# EAGLE design Schematic (EAGLE 7.3.0)
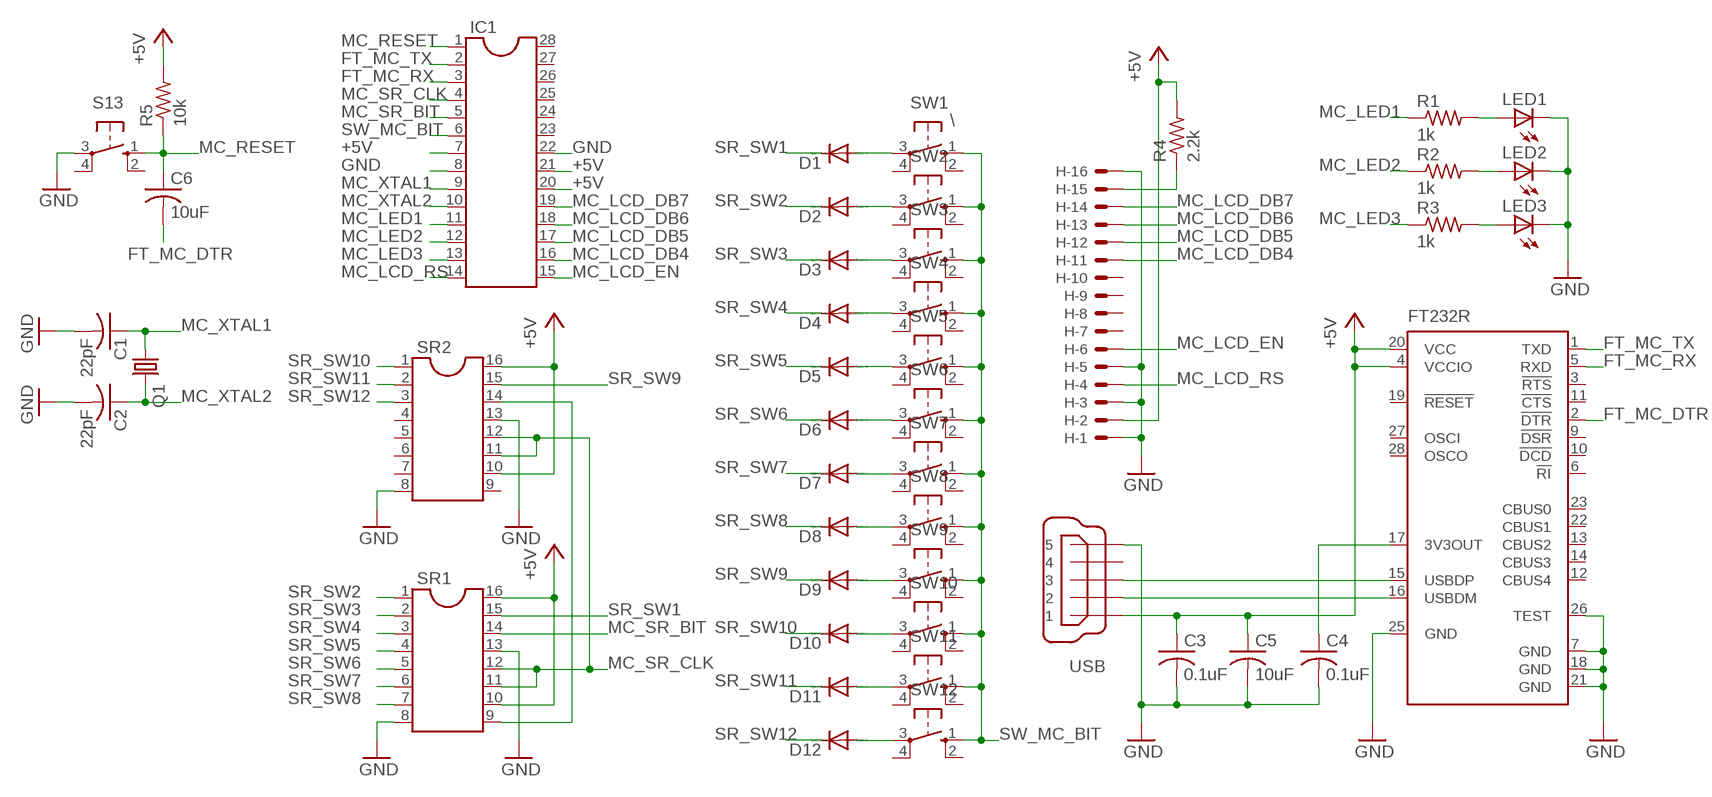
[diagram p0: schematic, sheet 1]

## Parts
C1  22pF  C-US025-024X044  [C025-024X044]
C2  22pF  C-US025-024X044  [C025-024X044]
C3  0.1uF  C-US025-024X044  [C025-024X044]
C4  0.1uF  C-US025-024X044  [C025-024X044]
C5  10uF  C-US025-024X044  [C025-024X044]
C6  10uF  C-US025-024X044  [C025-024X044]
D1  DIODE-DO35-10  [DO35-10]
D2  DIODE-DO35-10  [DO35-10]
D3  DIODE-DO35-10  [DO35-10]
D4  DIODE-DO35-10  [DO35-10]
D5  DIODE-DO35-10  [DO35-10]
D6  DIODE-DO35-10  [DO35-10]
D7  DIODE-DO35-10  [DO35-10]
D8  DIODE-DO35-10  [DO35-10]
D9  DIODE-DO35-10  [DO35-10]
D10  DIODE-DO35-10  [DO35-10]
D11  DIODE-DO35-10  [DO35-10]
D12  DIODE-DO35-10  [DO35-10]
FT232R  FT232RL  [SSOP28]
H  C-GRID-16-70543  [70543-16]
IC1  DIL28-3  [DIL28-3]
LED1  LED3MM  [LED3MM]
LED2  LED3MM  [LED3MM]
LED3  LED3MM  [LED3MM]
Q1  CRYSTALHC49U-V  [HC49U-V]
R1  1k  R-US_0204/2V  [0204V]
R2  1k  R-US_0204/2V  [0204V]
R3  1k  R-US_0204/2V  [0204V]
R4  2.2k  R-US_0204/2V  [0204V]
R5  10k  R-US_0204/2V  [0204V]
S13  10-XX  [B3F-10XX]
SR1  DIL16  [DIL16]
SR2  DIL16  [DIL16]
SW1  \  10-XX  [B3F-10XX]
SW2  10-XX  [B3F-10XX]
SW3  10-XX  [B3F-10XX]
SW4  10-XX  [B3F-10XX]
SW5  10-XX  [B3F-10XX]
SW6  10-XX  [B3F-10XX]
SW7  10-XX  [B3F-10XX]
SW8  10-XX  [B3F-10XX]
SW9  10-XX  [B3F-10XX]
SW10  10-XX  [B3F-10XX]
SW11  10-XX  [B3F-10XX]
SW12  10-XX  [B3F-10XX]
USB  MINI-USB_SHIELD5P2-32005-601  [32005-601]

## Nets
+5V: C3.1 C5.1 FT232R.4(VCCIO) FT232R.20(VCC) H.2 IC1.7 IC1.20 IC1.21 R4.2 R5.2 SR1.10 SR1.16 SR2.10 SR2.16 USB.1
FT_MC_DTR: C6.2 FT232R.2(!DTR)
FT_MC_RX: FT232R.5(RXD) IC1.3
FT_MC_TX: FT232R.1(TXD) IC1.2
GND: C1.2 C2.2 C3.2 C4.2 C5.2 FT232R.7(GND) FT232R.18(GND) FT232R.21(GND) FT232R.25(GND) FT232R.26(TEST) H.1 H.3 H.5 H.16 IC1.8 IC1.22 LED1.K(C) LED2.K(C) LED3.K(C) S13.3(P) SR1.8 SR1.13 SR2.8 SR2.13 USB.5
IDK: SR1.9 SR2.14
MC_LCD_DB4: H.11 IC1.16
MC_LCD_DB5: H.12 IC1.17
MC_LCD_DB6: H.13 IC1.18
MC_LCD_DB7: H.14 IC1.19
MC_LCD_EN: H.6 IC1.15
MC_LCD_RS: H.4 IC1.14
MC_LED1: IC1.11 R1.1
MC_LED2: IC1.12 R2.1
MC_LED3: IC1.13 R3.1
MC_RESET: C6.1 IC1.1 R5.1 S13.1(S)
MC_SR_BIT: IC1.5 SR1.14
MC_SR_CLK: IC1.4 SR1.11 SR1.12 SR2.11 SR2.12
MC_XTAL1: C1.1 IC1.9 Q1.1
MC_XTAL2: C2.1 IC1.10 Q1.2
N$1: D12.A SW12.3(P)
N$2: D11.A SW11.3(P)
N$3: D10.A SW10.3(P)
N$4: D9.A SW9.3(P)
N$5: D8.A SW8.3(P)
N$6: D7.A SW7.3(P)
N$7: D6.A SW6.3(P)
N$8: D5.A SW5.3(P)
N$9: D4.A SW4.3(P)
N$10: D1.A SW1.3(P)
N$11: D2.A SW2.3(P)
N$12: D3.A SW3.3(P)
N$13: FT232R.15(USBDP) USB.3
N$14: FT232R.16(USBDM) USB.2
N$16: LED1.A R1.2
N$17: LED2.A R2.2
N$18: H.15 R4.1
N$19: LED3.A R3.2
N$20: C4.1 FT232R.17(3V3OUT)
SR_SW1: D1.C SR1.15
SR_SW2: D2.C SR1.1
SR_SW3: D3.C SR1.2
SR_SW4: D4.C SR1.3
SR_SW5: D5.C SR1.4
SR_SW6: D6.C SR1.5
SR_SW7: D7.C SR1.6
SR_SW8: D8.C SR1.7
SR_SW9: D9.C SR2.15
SR_SW10: D10.C SR2.1
SR_SW11: D11.C SR2.2
SR_SW12: D12.C SR2.3
SW_MC_BIT: IC1.6 SW1.1(S) SW2.1(S) SW3.1(S) SW4.1(S) SW5.1(S) SW6.1(S) SW7.1(S) SW8.1(S) SW9.1(S) SW10.1(S) SW11.1(S) SW12.1(S)
Unconnected: FT232R.3(!RTS) FT232R.6(!RI) FT232R.9(!DSR) FT232R.10(!DCD) FT232R.11(!CTS) FT232R.12(CBUS4) FT232R.13(CBUS2) FT232R.14(CBUS3) FT232R.19(!RESET) FT232R.22(CBUS1) FT232R.23(CBUS0) FT232R.27(OSCI) FT232R.28(OSCO) H.7 H.8 H.9 H.10 IC1.23 IC1.24 IC1.25 IC1.26 IC1.27 IC1.28 S13.2(S1) S13.4(P1) SR2.4 SR2.5 SR2.6 SR2.7 SR2.9 SW1.2(S1) SW1.4(P1) SW2.2(S1) SW2.4(P1) SW3.2(S1) SW3.4(P1) SW4.2(S1) SW4.4(P1) SW5.2(S1) SW5.4(P1) SW6.2(S1) SW6.4(P1) SW7.2(S1) SW7.4(P1) SW8.2(S1) SW8.4(P1) SW9.2(S1) SW9.4(P1) SW10.2(S1) SW10.4(P1) SW11.2(S1) SW11.4(P1) SW12.2(S1) SW12.4(P1) USB.4 USB.M1(S1) USB.M2(S2)

## Library data of the parts
C1-C6 = rcl:C-US: CAPACITOR, American symbol
D1-D12 = diode:DIODE-: DIODE
FT232R = ftdichip:FT232R: Source: http://www.ftdichip.com/Documents/DataSheets/DS_FT232R_v104.pdf; MPN: FT232RL; OC_FARNELL: 1146032; OC_NEWARK: 91K9918
H = con-molex:C-GRID-16: CONNECTOR wire to board 2.54 mm (0.100") pitch header; OC_FARNELL: unknown; OC_NEWARK: unknown
IC1 = ic-package:DIL28: Dual In Line
LED1-LED3 = led:LED: LED OSRAM: - CHIPLED LG R971, LG N971, LY N971, LG Q971, LY Q971, LO R971, LY R971 LH N974, LH R974 LS Q976, LO Q976, LY Q976 LO Q996 - Hyper CHIPLED LW Q18S LB Q993, LB Q99A, LB R99A - SideLED LS A670, LO A670, LY A670, LG A670, LP A670 LB A673, LV A673, LT A673, LW A673 LH A674 LY A675 LS A676, LA A676, LO A676, LY A676, LW A676 LS A679, LY A679, LG A679 - Hyper Micro SIDELED® LS Y876, LA Y876, LO Y876, LY Y876 LT Y87S - SmartLED LW L88C, LW L88S LB L89C, LB L89S, LG L890 LS L89K, LO L89K, LY L89K LS L896, LA L896, LO L896, LY L896 - TOPLED LS T670, LO T670, LY T670, LG T670, LP T670 LSG T670, LSP T670, LSY T670, LOP T670, LYG T670 LG T671, LOG T671, LSG T671 LB T673, LV T673, LT T673, LW T673 LH T674 LS T676, LA T676, LO T676, LY T676, LB T676, LH T676, LSB T676, LW T676 LB T67C, LV T67C, LT T67C, LS T67K, LO T67K, LY T67K, LW E67C LS E67B, LA E67B, LO E67B, LY E67B, LB E67C, LV E67C, LT E67C LW T67C LS T679, LY T679, LG T679 LS T770, LO T770, LY T770, LG T770, LP T770 LB T773, LV T773, LT T773, LW T773 LH T774 LS E675, LA E675, LY E675, LS T675 LS T776, LA T776, LO T776, LY T776, LB T776 LHGB T686 LT T68C, LB T68C - Hyper Mini TOPLED® LB M676 - Mini TOPLED Santana® LG M470 LS M47K, LO M47K, LY M47K Source: http://www.osram.convergy.de LUXEON: - LUMILED® LXK2-PW12-R00, LXK2-PW12-S00, LXK2-PW14-U00, LXK2-PW14-V00 LXK2-PM12-R00, LXK2-PM12-S00, LXK2-PM14-U00 LXK2-PE12-Q00, LXK2-PE12-R00, LXK2-PE12-S00, LXK2-PE14-T00, LXK2-PE14-U00 LXK2-PB12-K00, LXK2-PB12-L00, LXK2-PB12-M00, LXK2-PB14-N00, LXK2-PB14-P00, LXK2-PB14-Q00 LXK2-PR12-L00, LXK2-PR12-M00, LXK2-PR14-Q00, LXK2-PR14-R00 LXK2-PD12-Q00, LXK2-PD12-R00, LXK2-PD12-S00 LXK2-PH12-R00, LXK2-PH12-S00 LXK2-PL12-P00, LXK2-PL12-Q00, LXK2-PL12-R00 Source: www.luxeon.com KINGBRIGHT: KA-3528ASYC Source: www.kingbright.com
Q1 = crystal:CRYSTAL: CRYSTAL; OC_FARNELL: 1666969; OC_NEWARK: unknown
R1-R5 = rcl:R-US_: RESISTOR, American symbol
S13 SW1-SW12 = switch-omron:10-XX: OMRON SWITCH; MPN: B3F-1000; OC_FARNELL: 176432; OC_NEWARK: 36M3542
SR1 SR2 = ic-package:DIL16: Dual In Line / Socket
USB = con-cypressindustries:MINI-USB_SHIELD5P2-: MINI USB-B R/A DIP 5pol. Source: www.cypressindustries.com; OC_FARNELL: unknown; OC_NEWARK: unknown

## Net classes
0 default: width 0.305 mm, drill 0.508 mm, clearance 0.254 mm

## Board
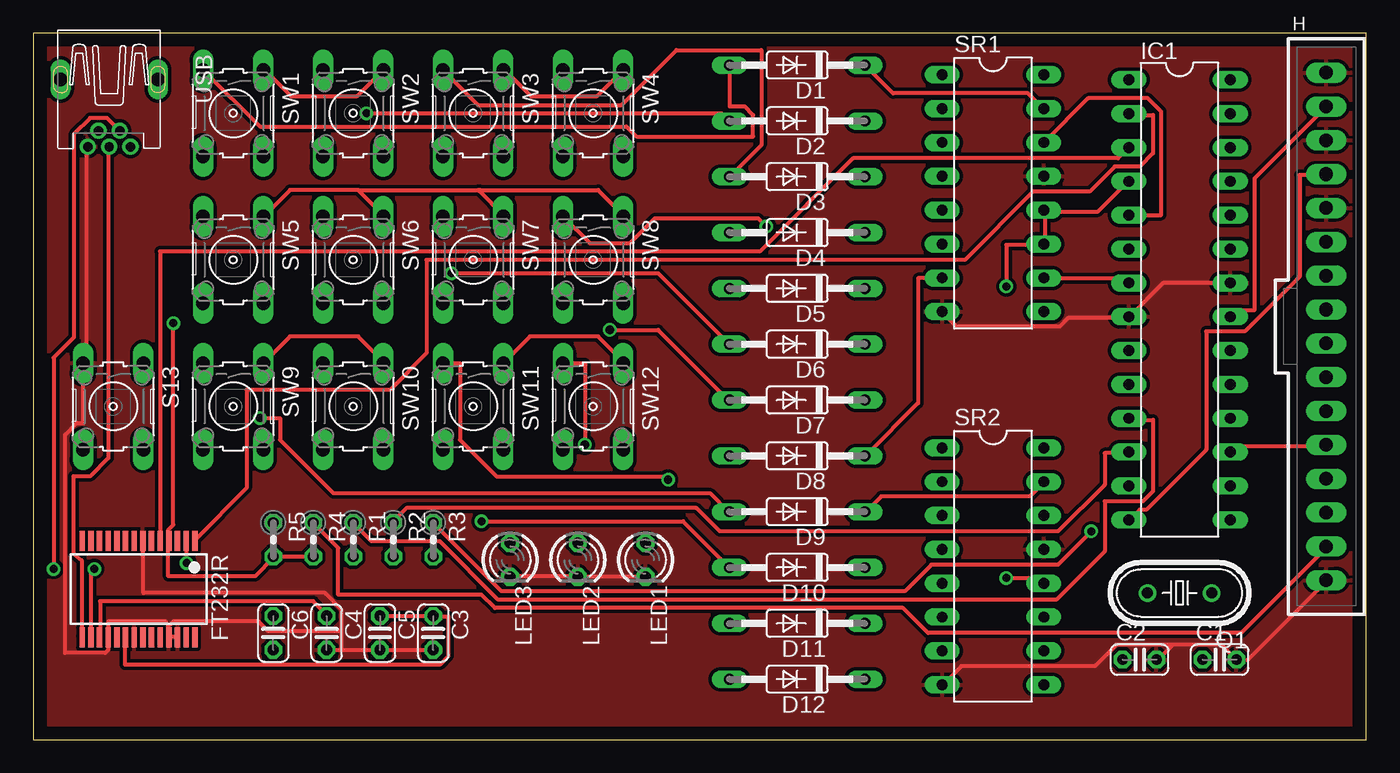
[diagram p1: board, top side]
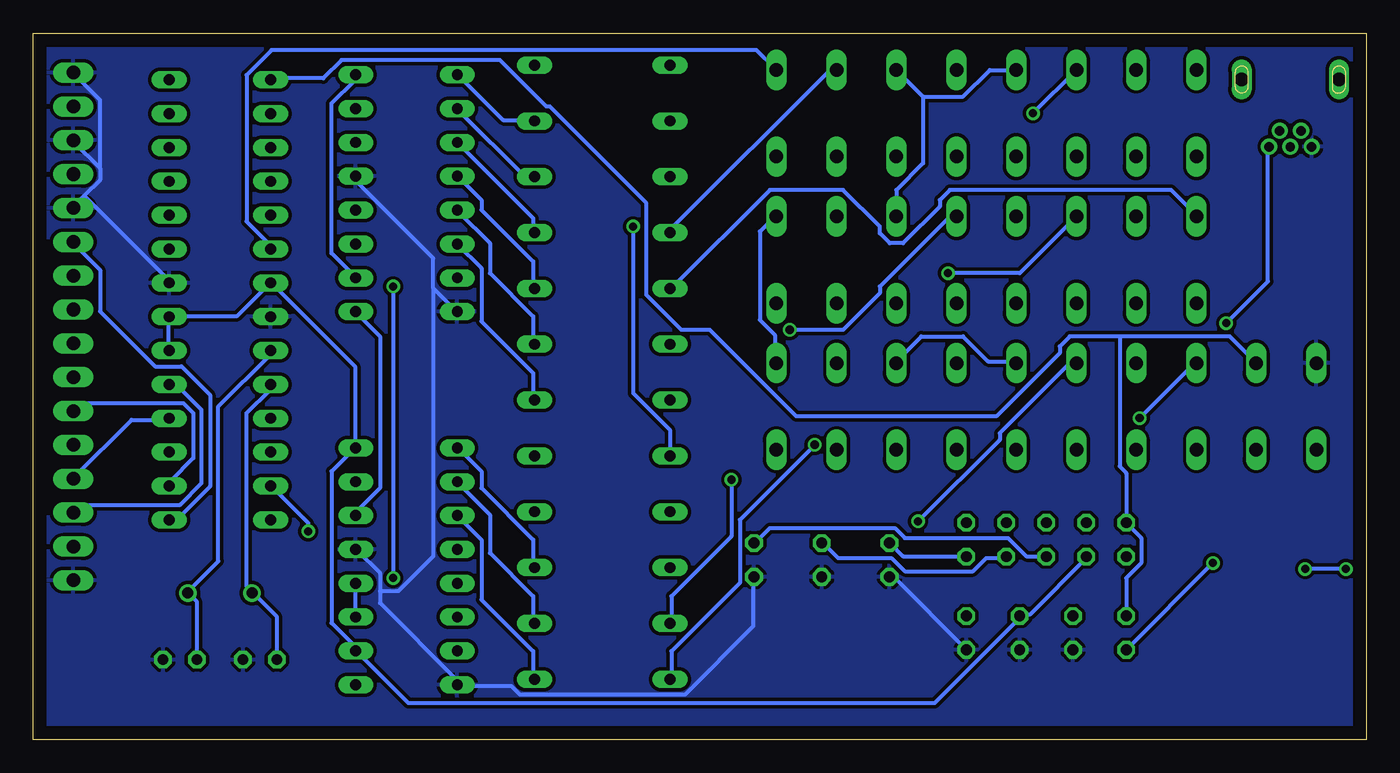
[diagram p2: board, bottom side, seen from below]

Size 100 x 53 mm. Coordinates in mm from the lower left corner, seen from the top.
Outline: 0,0 100,0 100,53 0,53 0,0
Copper layers (1*16): Top 0.035mm / dielectric 1.5mm / Bottom 0.035mm
Design rules "default": minimum track width 10mil, minimum drill 24mil, track to track 8mil, track to pad 8mil, pad to pad 8mil, via to via 8mil, smd to smd 8mil, copper to edge 40mil, drill to drill 8mil, minimum pad ring 10mil, minimum via ring 8mil, stop-mask expansion 4mil, vias tented up to drill 0mil, thermal gap 10mil

### Footprints (pad centres in the part's own frame; a part is rotated, then mirrored left to right if it is on the bottom)
C025-024X044 = drill 0.813 octagon: 1 -1.27,0; 2 1.27,0
DO35-10 = drill 0.813 long: A 5.08,0; C -5.08,0
SSOP28 = smd 0.4 x 1.5: 1 -4.225,-3.625; 2 -3.575,-3.625; 3 -2.925,-3.625; 4 -2.275,-3.625; 5 -1.625,-3.625; 6 -0.975,-3.625; 7 -0.325,-3.625; 8 0.325,-3.625; 9 0.975,-3.625; 10 1.625,-3.625; 11 2.275,-3.625; 12 2.925,-3.625; 13 3.575,-3.625; 14 4.225,-3.625; 15 4.225,3.625; 16 3.575,3.625; 17 2.925,3.625; 18 2.275,3.625; 19 1.625,3.625; 20 0.975,3.625; 21 0.325,3.625; 22 -0.325,3.625; 23 -0.975,3.625; 24 -1.625,3.625; 25 -2.275,3.625; 26 -2.925,3.625; 27 -3.575,3.625; 28 -4.225,3.625
70543-16 = drill 1.016 long: 1 -19.05,0; 2 -16.51,0; 3 -13.97,0; 4 -11.43,0; 5 -8.89,0; 6 -6.35,0; 7 -3.81,0; 8 -1.27,0; 9 1.27,0; 10 3.81,0; 11 6.35,0; 12 8.89,0; 13 11.43,0; 14 13.97,0; 15 16.51,0; 16 19.05,0
DIL28-3 = drill 0.813 long: 1 -16.51,-3.81; 2 -13.97,-3.81; 3 -11.43,-3.81; 4 -8.89,-3.81; 5 -6.35,-3.81; 6 -3.81,-3.81; 7 -1.27,-3.81; 8 1.27,-3.81; 9 3.81,-3.81; 10 6.35,-3.81; 11 8.89,-3.81; 12 11.43,-3.81; 13 13.97,-3.81; 14 16.51,-3.81; 15 16.51,3.81; 16 13.97,3.81; 17 11.43,3.81; 18 8.89,3.81; 19 6.35,3.81; 20 3.81,3.81; 21 1.27,3.81; 22 -1.27,3.81; 23 -3.81,3.81; 24 -6.35,3.81; 25 -8.89,3.81; 26 -11.43,3.81; 27 -13.97,3.81; 28 -16.51,3.81
LED3MM = drill 0.813 octagon: A -1.27,0; K 1.27,0
HC49U-V = drill 0.813: 1 -2.413,0; 2 2.413,0
0204V = drill 0.813 octagon: 1 -1.27,0; 2 1.27,0
B3F-10XX = drill 1.016 long: 1 -3.251,2.261; 2 3.251,2.261; 3 -3.251,-2.261; 4 3.251,-2.261
DIL16 = drill 0.813 long: 1 -8.89,-3.81; 2 -6.35,-3.81; 3 -3.81,-3.81; 4 -1.27,-3.81; 5 1.27,-3.81; 6 3.81,-3.81; 7 6.35,-3.81; 8 8.89,-3.81; 9 8.89,3.81; 10 6.35,3.81; 11 3.81,3.81; 12 1.27,3.81; 13 -1.27,3.81; 14 -3.81,3.81; 15 -6.35,3.81; 16 -8.89,3.81
32005-601 = drill 0.7 pad 1.016: 1 2.825,1.6; 2 1.625,0.8; 3 2.825,0; 4 1.625,-0.8; 5 2.825,-1.6 | drill 1 pad 1.422 long: M1 -2.225,3.65; M2 -2.225,-3.65

### Placement (x,y rotation side)
C1  89,6 0 top
C2  83,6 0 top
C3  30,8 270 top
C4  22,8 270 top
C5  26,8 270 top
C6  18,8 270 top
D1  57.31,50.61 180 top
D2  57.31,46.42 180 top
D3  57.31,42.23 180 top
D4  57.31,38.04 180 top
D5  57.31,33.85 180 top
D6  57.31,29.66 180 top
D7  57.31,25.47 180 top
D8  57.31,21.28 180 top
D9  57.31,17.09 180 top
D10  57.31,12.9 180 top
D11  57.31,8.71 180 top
D12  57.31,4.52 180 top
FT232R  7.89,11.29 180 top
H  97,31 270 top
IC1  86,33 270 top
LED1  45.93,13.48 270 top
LED2  40.85,13.48 270 top
LED3  35.77,13.48 270 top
Q1  86,11 180 top
R1  24,15 270 top
R2  27,15 270 top
R3  30,15 270 top
R4  21,15 270 top
R5  18,15 270 top
S13  6,25 270 top
SR1  72,41 270 top
SR2  72,13 270 top
SW1  15,47 270 top
SW2  24,47 270 top
SW3  33,47 270 top
SW4  42,47 270 top
SW5  15,36 270 top
SW6  24,36 270 top
SW7  33,36 270 top
SW8  42,36 270 top
SW9  15,25 270 top
SW10  24,25 270 top
SW11  33,25 270 top
SW12  42,25 270 top
USB  5.69,47.31 270 top

### Tracks (layer width: path | path; a pad name or v marks a point on that pad's centre or on a via)
+5V  (via drill 0.61)
  Top 0.305: FT232R.20 6.88,7.62 6.88,5.62 30.5,5.62 31.12,6.25 31.12,9.25 30,9.25 C3.1 29.88,9.25 26,9.25 C5.1 | v10.5,31.25 10.5,16.12 10.12,15.75 10.12,15 FT232R.4 10.12,14.88 10.12,12.25 16.62,12.25 18,13.62 R5.2 18.12,13.75 21,13.75 R4.2 | H.2 91.62,42.12 91.62,32.25 90.38,32.25 89.88,31.75 IC1.21 | IC1.7 82.12,34.38 81.88,34.62 75.88,34.62 SR1.10
  Bottom 0.305: v10.5,31.25 7.38,34.38 7.38,44.38 USB.1 | R4.2 21,13.62 25.25,9.38 26,9.38 C5.1 26,9.12 32.38,2.75 71.88,2.75 75.75,6.62 SR2.10 75.88,6.75 75.88,7 77.62,8.75 77.62,20.12 75.88,21.88 SR2.16 75.88,22 75.88,28 82.12,34.25 IC1.7 82.25,34.25 84.75,31.75 89.75,31.75 IC1.21 89.88,31.62 89.88,29.25 IC1.20 | SR1.16 75.88,49.88 75.88,49.5 77.62,47.75 77.62,36.5 75.88,34.75 SR1.10
FT_MC_DTR  (via drill 0.61)
  Top 0.305: v11.5,13.25 11.5,14.88 FT232R.2
  Bottom 0.305: v11.5,13.25 18,6.75 C6.2
FT_MC_RX
  Top 0.305: FT232R.5 9.5,15 9.5,36.62 54.5,36.62 61.5,43.62 81.38,43.62 82.12,44.38 IC1.3
FT_MC_TX
  Top 0.305: FT232R.1 12.12,15 16,18.88 16,26.25 26.75,26.25 29.5,29 29.5,36 69.88,36 75,41.12 79.25,41.12 81.12,43 83,43 84,44 84,46.88 82.25,46.88 IC1.2
GND
  Top 0.305: 85.44,7.06 85.5,7.12 89.12,7.12 90.25,6 C1.2 91.12,6 97,11.88 H.16 | 85.44,7.06 84.38,6 C2.2 | SR2.8 68.25,4.12 69.62,5.5 79.62,5.5 81.25,7.12 85.38,7.12 85.44,7.06 | IC1.22 89.75,34.25 84.75,34.25 82.25,31.75 IC1.8 82.12,31.62 77.62,31.62 77,31 69.25,31 68.25,32 SR1.8 | USB.5 4,44.38 4,28.38 3.75,28.38 S13.3 3.75,28.12 3.75,23.75 3.25,23.75 2.38,22.88 2.38,6.5 5.38,6.5 5.62,6.75 5.62,7.62 FT232R.18 5.62,7.75 5.62,8.88 9.88,8.88 10.12,8.62 | LED3.K 35.88,12.25 40.75,12.25 LED2.K 40.88,12.25 45.88,12.25 LED1.K | 10.12,8.62 10.12,7.75 FT232R.25 10.25,7.75 10.75,7.75 FT232R.26 | 23.12,6.75 23.12,8.12 | 23.12,8.12 23.12,9.75 21.88,11 8.25,11 8.25,14.88 FT232R.7 | 23.12,6.75 22,6.75 C4.2 | 23.12,6.75 26,6.75 C5.2 26.12,6.75 30,6.75 C3.2 | 23.12,8.12 17.62,8.12 16.88,8.88 10.5,8.88 10.25,8.62 10.12,8.62
  Bottom 0.305: 74,11.12 74,12.5 75.75,14.25 SR2.13 | 74,11.12 74,10.25 68.25,4.5 68.25,4.12 SR2.8 68.12,4 64.12,4 63.5,3.38 51.12,3.38 46,8.5 46,12.12 LED1.K | 96.19,40.81 95,42 95,42.88 | 96.19,40.81 97,40 H.5 | 95,42.88 97,44.88 H.3 | 95,42.88 95,48 97,50 H.1 | 70,33.88 70,36.12 75.75,41.88 75.75,42.25 SR1.13 | 70,33.88 68.25,32.12 SR1.8 | 96.19,40.81 89.75,34.38 IC1.22 | 74,11.12 72.62,11.12 70,13.75 70,33.88 | LED3.K 35.75,12.12 35.38,12.12 30,6.75 C3.2
  pour Bottom: -1,54 101,54 101,-1 -1,-1
  pour Top: -1,54 101,54 101,-1 -1,-1
IDK
  Bottom 0.305: SR2.14 75.75,16.88 75.75,17.12 74,18.88 74,30.25 75.75,32 SR1.9
MC_LCD_DB4
  Bottom 0.305: IC1.16 89.75,19.12 89.75,19.38 88,21.12 88,24.5 88.75,25.25 96.5,25.25 97,24.75 H.11
MC_LCD_DB5
  Top 0.305: IC1.17 89.88,21.62 90.25,22 97,22 H.12
MC_LCD_DB6
  Bottom 0.305: IC1.18 89.88,24 92.62,24 97,19.62 H.13
MC_LCD_DB7
  Bottom 0.305: IC1.19 89.75,26.62 89.25,26.62 87.38,24.75 87.38,19.25 89,17.62 96.5,17.62 97,17.12 H.14
MC_LCD_EN
  Bottom 0.305: IC1.15 89.75,16.5 89.25,16.5 86.75,19 86.75,25.88 88.88,28 90.88,28 95,32.12 95,35.25 97,37.25 H.6
MC_LCD_RS
  Top 0.305: IC1.14 82.25,16.5 83,17.25 83.5,17.25 88,21.75 88,30.62 90.88,30.62 95,34.75 95,42.38 97,42.38 H.4
MC_LED1
  Top 0.305: R1.1 24,16.25 25.38,14.88 30.5,14.88 34.88,10.5 76.75,10.5 80.38,14.12 80.38,17.88 83.25,17.88 84,18.62 84,24 82.25,24 IC1.11
MC_LED2
  Top 0.305: R2.1 27,16.38 28,17.38 49.75,17.38 51.5,15.62 76.88,15.62 80.38,19.12 80.38,21.5 82.12,21.5 IC1.12
MC_LED3  (via drill 0.61)
  Top 0.305: v79.38,15.62 76.88,13.12 67.38,13.12 65.38,11.12 35.12,11.12 30,16.25 R3.1
  Bottom 0.305: v79.38,15.62 79.38,16.25 82.12,19 IC1.13
MC_RESET
  Bottom 0.305: C6.1 18,12.12 16.88,13.25 16.88,15.12 18,16.25 R5.1 18,20 18.5,20.5 18.5,30.25 | 18.5,30.25 10.25,30.25 8.38,28.38 S13.1 | 18.5,30.25 22.25,30.25 23,29.5 23,29 27.75,24.25 42.75,24.25 49.25,30.75 51.38,30.75 54,33.38 54,40.25 61.25,47.5 61.5,47.5 65,51 76.88,51 78.25,49.62 82.12,49.62 IC1.1
MC_SR_BIT
  Top 0.305: SR1.14 79.12,48.12 83.62,48.12 84.62,47.12 84.62,39.38 82.25,39.38 IC1.5
MC_SR_CLK  (via drill 0.61)
  Top 0.305: IC1.4 82.12,41.88 79.88,39.62 76,39.62 SR1.12 75.88,39.62 75.88,37.25 SR1.11 75.75,37.12 73,37.12 v73,34 | v73,12.12 75.38,12.12 75.75,11.75 SR2.12
  Bottom 0.305: SR2.11 75.88,9.25 75.88,11.62 SR2.12 | v73,34 v73,12.12
MC_XTAL1
  Bottom 0.305: C1.1 87.75,6 87.75,10.38 88.38,11 Q1.1 88.38,11.12 86.12,13.38 86.12,25 82.25,28.88 82.25,29.12 IC1.9
MC_XTAL2
  Bottom 0.305: C2.1 81.75,6 81.75,9.25 83.5,11 Q1.2 83.62,11.12 84,11.5 84,24.5 82.25,26.25 82.25,26.62 IC1.10
N$1  (via drill 0.61)
  Top 0.305: v41.38,22.12 41.38,28.25 SW12.3
  Bottom 0.305: v41.38,22.12 47,16.5 47,11.75 52.12,6.62 52.12,4.62 D12.A
N$2  (via drill 0.61)
  Top 0.305: v47.62,19.5 47.38,19.75 34.75,19.75 32,22.5 32,28.25 SW11.3
  Bottom 0.305: v47.62,19.5 47.62,15.25 52.12,10.75 52.12,8.75 D11.A
N$3  (via drill 0.61)
  Top 0.305: v33.62,16.38 48.75,16.38 52.12,13 D10.A
  Bottom 0.305: v33.62,16.38 27.5,22.5 27.5,23 22.25,28.25 SW10.3
N$4  (via drill 0.61)
  Top 0.305: v17,24.12 18.5,24.12 18.5,22.5 22.5,18.5 50.75,18.5 52.12,17.12 D9.A
  Bottom 0.305: v17,24.12 12.75,28.38 SW9.3
N$5  (via drill 0.61)
  Top 0.305: v55,38.5 54.38,39.12 46.62,39.12 44.75,37.25 41.75,37.25 SW8.3
  Bottom 0.305: v55,38.5 55,26 52.25,23.25 52.25,21.38 D8.A
N$6  (via drill 0.61)
  Top 0.305: v43.25,30.75 46.88,30.75 52.12,25.5 D7.A
  Bottom 0.305: v43.25,30.75 39.25,30.75 36.5,33.5 36.5,34 31.25,39.25 SW7.3
N$7  (via drill 0.61)
  Top 0.305: v31.38,35 46.88,35 52.12,29.75 D6.A
  Bottom 0.305: v31.38,35 26,35 SW6.3
N$8
  Bottom 0.305: D5.A 52.12,33.88 44.75,41.25 39.25,41.25 36.5,38.5 36.5,38 35.75,37.25 34.75,37.25 32,40 32,40.5 31.25,41.25 14.62,41.25 12.75,39.38 SW5.3
N$9
  Bottom 0.305: D4.A 52.12,38.12 52.12,38.38 40.25,50.25 SW4.3
N$10
  Top 0.305: D1.A 52.25,50.5 52.25,47.5 53.38,47.5 54,46.88 54,45.25 45.25,45.25 44.5,46 17,46 SW1.3
N$11  (via drill 0.61)
  Top 0.305: v25,47 51.62,47 52.12,46.5 D2.A
  Bottom 0.305: v25,47 SW2.3
N$12
  Top 0.305: D3.A 52.25,42.25 54.62,44.62 54.62,51.75 48.25,51.75 44.12,47.62 33.38,47.62 SW3.3
N$13
  Top 0.305: FT232R.15 3.62,7.75 3.62,13.45 3.25,13.75 3,14 3,19.75 4.25,19.75 5.62,21.12 5.62,44.38 USB.3
N$14  (via drill 0.6)
  Top 0.305: USB.2 5.54,46.63 4.27,46.63 3.05,45.41 3.05,30.18 1.52,28.65 v1.52,12.8 | v4.57,12.8 4.32,12.54 FT232R.16
  Bottom 0.305: v1.52,12.8 v4.57,12.8
N$16
  Bottom 0.305: R1.2 24,13.75 25.5,13.75 26.88,15.12 34.62,15.12 35.38,15.88 44.75,15.88 45.88,14.75 LED1.A
N$17
  Bottom 0.305: R2.2 27,13.62 28.5,13.62 29.5,12.62 34.62,12.62 35.62,13.62 39.62,13.62 40.75,14.75 LED2.A
N$18
  Top 0.305: R4.1 21,16.25 22.88,14.38 22.88,10.88 33.62,10.88 34.62,9.88 65.25,9.88 67.12,8 90.62,8 97,14.38 H.15
N$19
  Bottom 0.305: R3.2 30,13.75 34.75,13.75 35.75,14.75 LED3.A
N$20
  Top 0.305: FT232R.17 5,7.75 5,10.38 21,10.38 22,9.38 C4.1
SR_SW1
  Top 0.305: D1.C 62.5,50.5 64.5,48.5 74.62,48.5 75.75,47.38 SR1.15
SR_SW2
  Bottom 0.305: D2.C 62.5,46.5 64.75,46.5 68.12,49.88 SR1.1
SR_SW3
  Bottom 0.305: D3.C 62.5,42.25 63.12,42.25 68.12,47.25 SR1.2
SR_SW4
  Bottom 0.305: D4.C 62.5,38.12 62.5,39.12 68.12,44.75 SR1.3
SR_SW5
  Bottom 0.305: D5.C 62.5,33.88 62.5,35.88 66.38,39.75 66.38,40.5 68.12,42.25 SR1.4
SR_SW6
  Bottom 0.305: D6.C 62.5,29.75 62.5,31.75 65.75,35 65.75,37.25 68.12,39.62 SR1.5
SR_SW7
  Bottom 0.305: SR1.6 66.38,35.38 66.38,31.38 62.5,27.5 62.5,25.5 D7.C
SR_SW8
  Top 0.305: D8.C 62.5,21.38 66.38,25.25 66.38,34.62 68.12,34.62 SR1.7
SR_SW9
  Top 0.305: D9.C 62.5,17.12 63.62,18.25 74.75,18.25 75.75,19.25 SR2.15
SR_SW10
  Bottom 0.305: D10.C 62.5,13 62.5,15 66.38,18.88 66.38,20.12 68.12,21.88 SR2.1
SR_SW11
  Bottom 0.305: D11.C 62.5,8.75 62.5,10.75 65.75,14 65.75,16.88 68.12,19.25 SR2.2
SR_SW12
  Bottom 0.305: D12.C 62.5,4.62 62.5,6.62 66.38,10.5 66.38,15 68.12,16.75 SR2.3
SW_MC_BIT
  Top 0.305: SW9.1 17.38,28.38 19.25,30.25 24.38,30.25 26.25,28.38 SW10.1 | SW11.1 35.38,28.38 37.25,30.25 42.38,30.25 44.25,28.38 SW12.1 | 24.38,41.25 19.25,41.25 17.38,39.38 SW5.1 | 24.38,41.25 26.25,39.38 SW6.1 | 33.44,41.19 33.38,41.25 24.38,41.25 | 33.44,41.19 35.25,39.38 SW7.1 | SW8.1 44.25,39.38 42.38,41.25 33.5,41.25 33.44,41.19 | SW1.1 17.38,50.25 19.38,48.25 24.25,48.25 SW2.1 | SW3.1 35.38,50.25 37.38,48.25 42.25,48.25 SW4.1
  Bottom 0.305: SW10.1 26.38,28.38 28.38,28.38 30.25,30.25 33.38,30.25 35.25,28.38 SW11.1 | SW12.1 44.38,28.38 44.38,30.38 45.5,31.5 45.5,38.12 44.38,39.25 SW8.1 | IC1.6 82.25,36.88 82.25,37.12 84,38.88 84,49.88 82.12,51.75 45.75,51.75 44.38,50.38 SW4.1 | 33.25,48.25 30.25,48.25 28.25,50.25 26.38,50.25 SW2.1 | 33.25,48.25 SW3.1 | 33.25,48.25 33.25,43.25 35.25,41.25 35.25,39.38 SW7.1